# EasyEDA Pro project ProPrj_cap banks_2026-02-15.epro, board PCB5_1
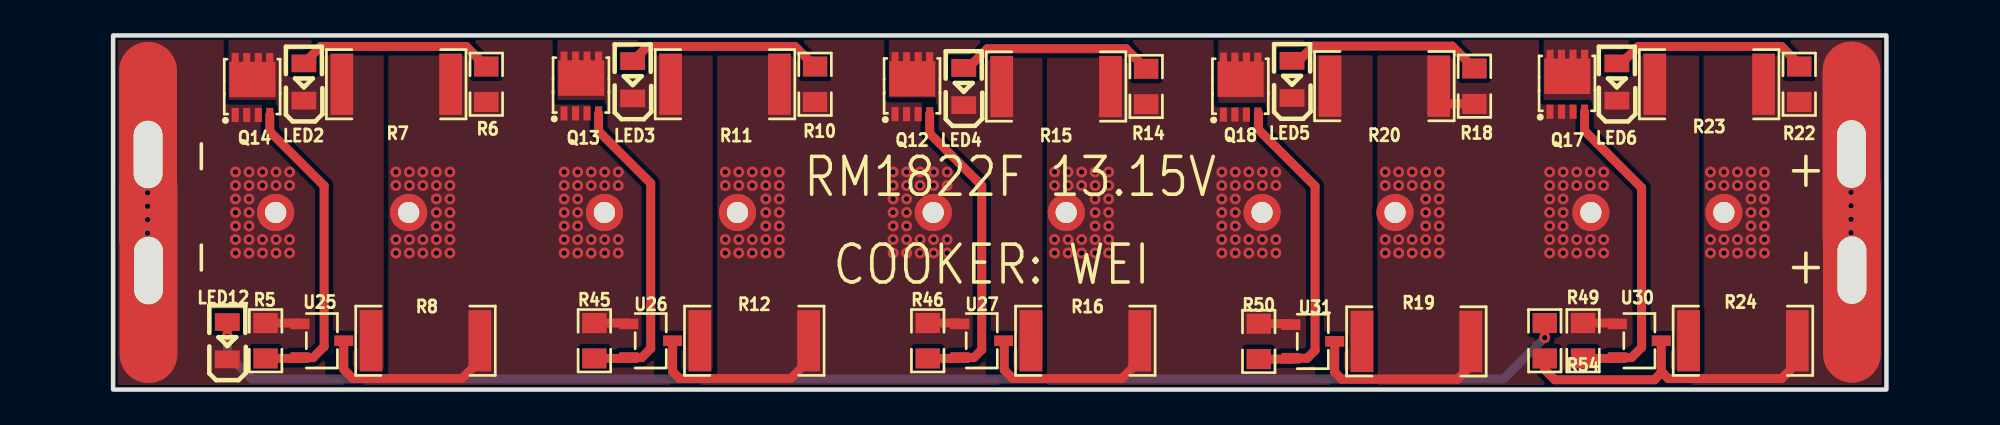
[diagram p6: board, top side]
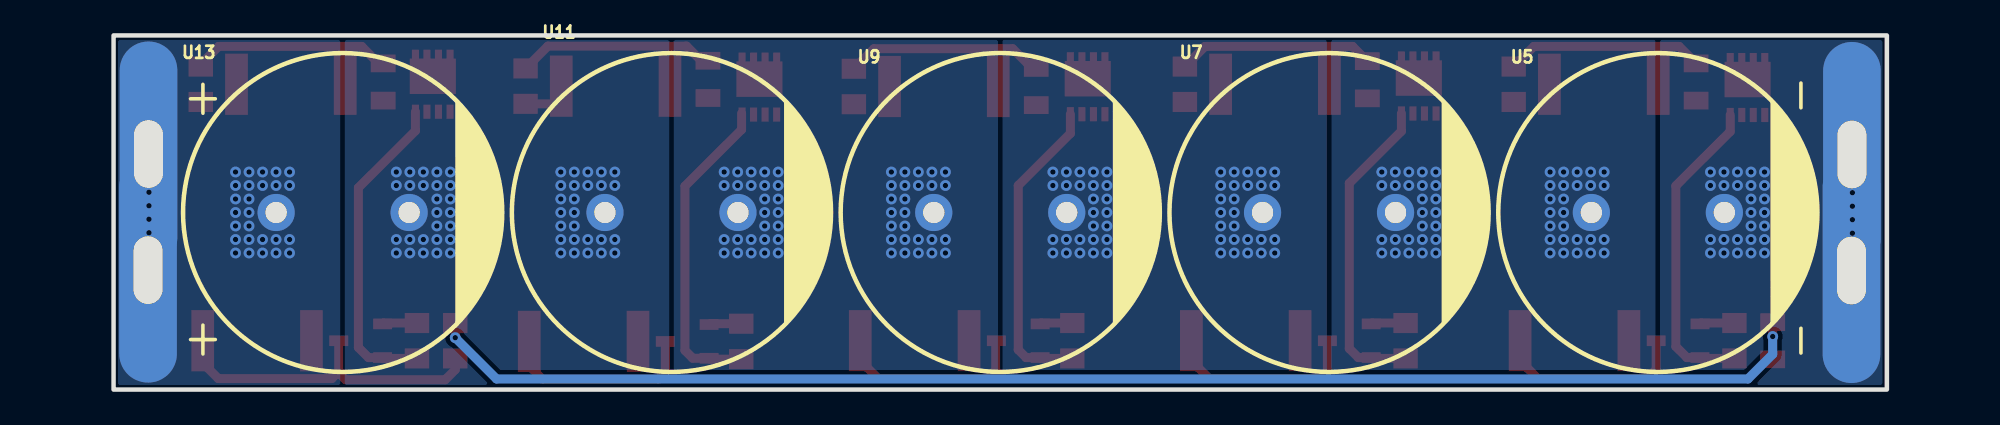
[diagram p7: board, bottom side, seen from below]

Outline 100 x 19.99 mm; copper layers: Top Layer, Bottom Layer. Coordinates in mm from the lower left corner of the outline.
Outline path: rectangle 0,19.99 100,0
Stack: Top Layer 0.035mm / Dielectric1 1.51mm FR4 er 4.5 / Bottom Layer 0.035mm

## Design rules (mm)
template: Custom Config
spacing copperThickness1oz (default): track to track 0.102, other pairs 0.152 to 0.3
spacing copperThickness2oz: track to track 0.203, other pairs 0.152 to 0.3
track width copperThickness1oz (default): min 0.127, default 0.508, max 2.54
track width copperThickness2oz: min 0.203, default 0.254, max 2.54
differential pair differentialPair (default): width min 0.127, default 0.254, max 2.54; gap min 0.152, default 0.152
via viaSize (default): diameter min 0.5, default 0.61, max 10; hole min 0.3, default 0.305, max 6.3

## Placement (name value [footprint] x y rotation side)
LED2  NCD0805R1  [LED0805-R-RD]  10.76 17.36 90 top
LED3  NCD0805R1  [LED0805-R-RD]  29.3 17.49 90 top
LED4  NCD0805R1  [LED0805-R-RD]  47.97 17.11 90 top
LED5  NCD0805R1  [LED0805-R-RD]  66.48 17.51 90 top
LED6  NCD0805R1  [LED0805-R-RD]  84.8 17.36 90 top
LED12  KT-0805G  [LED0805-R-RD]  6.44 2.76 90 top
NOREF  -  [Pad_e1076]  98.06 6.74 270 top
NOREF#2  -  [Pad_e1103]  1.97 13.27 90 top
NOREF#3  -  [Pad_e1102]  2 6.72 270 top
NOREF#4  -  [Pad_e1077]  98.03 13.3 90 top
Q12  AP2045Q  [DFN-8_L3.1-W3.0-P0.65-LS3.3-BL]  45.07 17.09 0 top
Q13  AP2045Q  [DFN-8_L3.1-W3.0-P0.65-LS3.3-BL]  26.4 17.14 0 top
Q14  AP2045Q  [DFN-8_L3.1-W3.0-P0.65-LS3.3-BL]  7.86 17.05 0 top
Q17  AP2045Q  [DFN-8_L3.1-W3.0-P0.65-LS3.3-BL]  82 17.23 0 top
Q18  AP2045Q  [DFN-8_L3.1-W3.0-P0.65-LS3.3-BL]  63.58 17.07 0 top
R5  30kΩ  [R0805]  8.6 2.76 270 top
R6  100Ω  [R0805]  21.04 17.23 270 top
R7  1Ω  [R2512]  15.96 17.23 0 top
R8  1Ω  [R2512]  17.62 2.76 0 top
R10  100Ω  [R0805]  39.59 17.23 270 top
R11  1Ω  [R2512]  34.51 17.23 0 top
R12  1Ω  [R2512]  36.16 2.76 0 top
R14  100Ω  [R0805]  58.26 17.11 270 top
R15  1Ω  [R2512]  53.17 17.11 0 top
R16  1Ω  [R2512]  54.83 2.76 0 top
R18  100Ω  [R0805]  76.77 17.13 270 top
R19  1Ω  [R2512]  73.49 2.72 0 top
R20  1Ω  [R2512]  71.69 17.13 0 top
R22  100Ω  [R0805]  95.08 17.23 270 top
R23  1Ω  [R2512]  90.01 17.23 0 top
R24  1Ω  [R2512]  91.91 2.76 0 top
R45  30kΩ  [R0805]  27.14 2.76 270 top
R46  30kΩ  [R0805]  45.94 2.76 270 top
R49  30kΩ  [R0805]  82.89 2.76 270 top
R50  30kΩ  [R0805]  64.61 2.72 270 top
R54  30kΩ  [R0805]  80.73 2.76 270 top
U5  1500uF  [CAP-TH_BD18.0-P7.50-D0.8-FD]  12.92 10 180 bottom
U7  1500uF  [CAP-TH_BD18.0-P7.50-D0.8-FD]  31.46 10 180 bottom
U9  1500uF  [CAP-TH_BD18.0-P7.50-D0.8-FD]  50 10 180 bottom
U11  1500uF  [CAP-TH_BD18.0-P7.50-D0.8-FD]  68.54 10 180 bottom
U13  1500uF  [CAP-TH_BD18.0-P7.50-D0.8-FD]  87.08 10 180 bottom
U25  LN809C2641MR-G  [SOT-23-3_L2.9-W1.6-P1.90-LS2.8-BR]  11.77 2.76 180 top
U26  LN809C2641MR-G  [SOT-23-3_L2.9-W1.6-P1.90-LS2.8-BR]  30.32 2.76 180 top
U27  LN809C2641MR-G  [SOT-23-3_L2.9-W1.6-P1.90-LS2.8-BR]  48.98 2.76 180 top
U30  LN809C2641MR-G  [SOT-23-3_L2.9-W1.6-P1.90-LS2.8-BR]  86.07 2.76 180 top
U31  LN809C2641MR-G  [SOT-23-3_L2.9-W1.6-P1.90-LS2.8-BR]  67.65 2.72 180 top

## Footprints (pads in the part's own frame, mm; a bottom-side part is the same pattern mirrored in y, then rotated)
CAP-TH_BD18.0-P7.50-D0.8-FD
  round 2.1 hole 1.2: 1(-3.75,0) 2(3.75,0)
DFN-8_L3.1-W3.0-P0.65-LS3.3-BL
  rect 0.4x0.8 smd: 1(-0.975,-1.55) 2(-0.325,-1.55) 3(0.326,-1.55) 4(0.975,-1.55) 5(0.975,1.55) 6(0.325,1.55) 7(-0.325,1.55) 8(-0.975,1.55)
  rect 2.6x2 smd: 8(-0.004,0.45)
LED0805-R-RD
  rect 1x1.399 smd: 1(1.05,0) 2(-1.05,0)
Pad_e1076
  oval 12.7x3.251 hole 3.81x1.625: 1(0,0)
Pad_e1077
  oval 12.7x3.251 hole 3.81x1.625: 1(0,0)
Pad_e1102
  oval 12.7x3.251 hole 3.81x1.625: 1(0,0)
Pad_e1103
  oval 12.7x3.251 hole 3.81x1.625: 1(0,0)
R0805
  rect 1.133x1.377 smd: 1(-1,0) 2(1,0)
R2512
  rect 1.282x3.456 smd: 1(-3.067,0) 2(3.067,0)
SOT-23-3_L2.9-W1.6-P1.90-LS2.8-BR
  rect 1.07x0.6 smd: 1(1.235,-0.95) 2(1.235,0.95) 3(-1.235,0)

## Nets
As in the schematic, except:
IN: LED12.2 NOREF#2.1 NOREF#3.1 Q14.1 Q14.2 Q14.3 R5.1 U5.2 U25.1
OUT: NOREF.1 NOREF#4.1 R22.2 R23.2 R24.2 R54.2 U13.1 U30.3

## Via types
v1: diameter 0.61, hole 0.305, Top Layer to Bottom Layer, 282 vias

## Routing (per net, layer and track width the routed paths; a pad name or vN(x,y) marks a point on that pad's centre or on a via; arc(x,y) is an arc through that point)
IN: length 2
  Top Layer w0.508: U25.1 10.49,3.76 R5.1
  vias: v1(1.95,13.4) v1(1.95,12.64) v1(1.95,11.87) v1(1.95,11.11) v1(1.95,10.35) v1(1.95,9.59) v1(1.95,8.83) v1(1.95,8.06) v1(1.95,7.3) v1(1.95,6.54) v1(6.9,12.28) v1(6.9,11.52) v1(6.9,10.76) v1(6.9,10) v1(6.9,9.23) v1(6.9,8.47) v1(6.9,7.71) v1(7.66,12.28) v1(7.66,11.52) v1(7.66,10.76) v1(7.66,10) v1(7.66,9.23) v1(7.66,8.47) v1(7.66,7.71) v1(8.43,12.28) v1(8.43,11.52) v1(8.43,8.47) v1(8.43,7.71) v1(9.19,12.28) v1(9.19,11.52) v1(9.19,8.47) v1(9.19,7.71) v1(9.95,12.28) v1(9.95,11.52) v1(9.95,8.47) v1(9.95,7.71)
NET2: length 13
  Top Layer w0.508: R8.2 20.68,1.63 19.67,0.62 13.53,0.62 13.01,1.14 U25.3 ; U26.1 29.03,3.76 R45.1
  vias: v1(15.94,12.28) v1(15.94,11.52) v1(15.94,8.47) v1(15.94,7.71) v1(16.71,12.28) v1(16.71,11.52) v1(16.71,8.47) v1(16.71,7.71) v1(17.47,12.28) v1(17.47,11.52) v1(17.47,8.47) v1(17.47,7.71) v1(18.23,12.28) v1(18.23,11.52) v1(18.23,10.76) v1(18.23,10) v1(18.23,9.23) v1(18.23,8.47) v1(18.23,7.71) v1(18.99,12.28) v1(18.99,11.52) v1(18.99,10.76) v1(18.99,10) v1(18.99,9.23) v1(18.99,8.47) v1(18.99,7.71) v1(25.44,12.28) v1(25.44,11.52) v1(25.44,10.76) v1(25.44,10) v1(25.44,9.23) v1(25.44,8.47) v1(25.44,7.71) v1(26.2,12.28) v1(26.2,11.52) v1(26.2,10.76) v1(26.2,10) v1(26.2,9.23) v1(26.2,8.47) v1(26.2,7.71) v1(26.96,12.28) v1(26.96,11.52) v1(26.96,8.47) v1(26.96,7.71) v1(27.72,12.28) v1(27.72,11.52) v1(27.72,8.47) v1(27.72,7.71) v1(28.48,12.28) v1(28.48,11.52) v1(28.48,8.47) v1(28.48,7.71)
NET3: length 13
  Top Layer w0.508: U26.3 31.55,1.01 31.94,0.62 38.21,0.62 39.22,1.63 R12.2 ; R46.1 47.7,3.76 47.75,3.71
  vias: v1(34.52,12.28) v1(34.52,11.52) v1(34.52,8.47) v1(34.52,7.71) v1(35.28,12.28) v1(35.28,11.52) v1(35.28,8.47) v1(35.28,7.71) v1(36.04,12.28) v1(36.04,11.52) v1(36.04,8.47) v1(36.04,7.71) v1(36.81,12.28) v1(36.81,11.52) v1(36.81,10.76) v1(36.81,10) v1(36.81,9.23) v1(36.81,8.47) v1(36.81,7.71) v1(37.57,12.28) v1(37.57,11.52) v1(37.57,10.76) v1(37.57,10) v1(37.57,9.23) v1(37.57,8.47) v1(37.57,7.71) v1(43.98,12.28) v1(43.98,11.52) v1(43.98,10.76) v1(43.98,10) v1(43.98,9.23) v1(43.98,8.47) v1(43.98,7.71) v1(44.75,12.28) v1(44.75,11.52) v1(44.75,10.76) v1(44.75,10) v1(44.75,9.23) v1(44.75,8.47) v1(44.75,7.71) v1(45.51,12.28) v1(45.51,11.52) v1(45.51,8.47) v1(45.51,7.71) v1(46.27,12.28) v1(46.27,11.52) v1(46.27,8.47) v1(46.27,7.71) v1(47.03,12.28) v1(47.03,11.52) v1(47.03,8.47) v1(47.03,7.71)
NET4: length 12.9
  Top Layer w0.508: R16.2 57.89,1.63 56.88,0.62 50.74,0.62 50.25,1.11 50.25,2.72 U27.3 ; R50.1 66.37,3.72 U31.1
  vias: v1(53.09,12.28) v1(53.09,11.52) v1(53.09,8.47) v1(53.09,7.71) v1(53.85,12.28) v1(53.85,11.52) v1(53.85,8.47) v1(53.85,7.71) v1(54.62,12.28) v1(54.62,11.52) v1(54.62,8.47) v1(54.62,7.71) v1(55.38,12.28) v1(55.38,11.52) v1(55.38,10.76) v1(55.38,10) v1(55.38,9.23) v1(55.38,8.47) v1(55.38,7.71) v1(56.14,12.28) v1(56.14,11.52) v1(56.14,10.76) v1(56.14,10) v1(56.14,9.23) v1(56.14,8.47) v1(56.14,7.71) v1(62.52,12.28) v1(62.52,11.52) v1(62.52,10.76) v1(62.52,10) v1(62.52,9.23) v1(62.52,8.47) v1(62.52,7.71) v1(63.28,12.28) v1(63.28,11.52) v1(63.28,10.76) v1(63.28,10) v1(63.28,9.23) v1(63.28,8.47) v1(63.28,7.71) v1(64.05,12.28) v1(64.05,11.52) v1(64.05,8.47) v1(64.05,7.71) v1(64.81,12.28) v1(64.81,11.52) v1(64.81,8.47) v1(64.81,7.71) v1(65.57,12.28) v1(65.57,11.52) v1(65.57,8.47) v1(65.57,7.71)
NET5: length 16.2
  Top Layer w0.508: 84.83,3.71 84.78,3.76 R49.1 ; R18.2 74.98,16.13 74.76,16.35 R20.2 ; 76.69,2.72 76.69,1.47 75.81,0.58 69.28,0.58 68.89,0.98 U31.3
  vias: v1(71.73,12.28) v1(71.73,11.52) v1(71.73,8.47) v1(71.73,7.71) v1(72.5,12.28) v1(72.5,11.52) v1(72.5,8.47) v1(72.5,7.71) v1(73.26,12.28) v1(73.26,11.52) v1(73.26,8.47) v1(73.26,7.71) v1(74.02,12.28) v1(74.02,11.52) v1(74.02,10.76) v1(74.02,10) v1(74.02,9.23) v1(74.02,8.47) v1(74.02,7.71) v1(74.78,12.28) v1(74.78,11.52) v1(74.78,10.76) v1(74.78,10) v1(74.78,9.23) v1(74.78,8.47) v1(74.78,7.71) v1(81.01,12.28) v1(81.01,11.52) v1(81.01,10.76) v1(81.01,10) v1(81.01,9.23) v1(81.01,8.47) v1(81.01,7.71) v1(81.77,12.28) v1(81.77,11.52) v1(81.77,10.76) v1(81.77,10) v1(81.77,9.23) v1(81.77,8.47) v1(81.77,7.71) v1(82.53,12.28) v1(82.53,11.52) v1(82.53,8.47) v1(82.53,7.71) v1(83.3,12.28) v1(83.3,11.52) v1(83.3,8.47) v1(83.3,7.71) v1(84.06,12.28) v1(84.06,11.52) v1(84.06,8.47) v1(84.06,7.71)
OUT: length 19
  Top Layer w0.508: U30.3 87.3,1.01 87.34,0.98 ; 87.24,0.88 87.44,0.88 ; 87.24,0.88 86.91,0.55 81.3,0.55 80.73,1.12 R54.2 ; 87.24,0.88 87.34,0.98 ; 87.44,0.88 87.69,0.62 94.09,0.62 94.98,1.5 R24.2 ; 87.44,0.88 87.34,0.98
  vias: v1(90.08,12.28) v1(90.08,11.52) v1(90.08,8.47) v1(90.08,7.71) v1(90.84,12.28) v1(90.84,11.52) v1(90.84,8.47) v1(90.84,7.71) v1(91.6,12.28) v1(91.6,11.52) v1(91.6,8.47) v1(91.6,7.71) v1(92.36,12.28) v1(92.36,11.52) v1(92.36,10.76) v1(92.36,10) v1(92.36,9.23) v1(92.36,8.47) v1(92.36,7.71) v1(93.13,12.28) v1(93.13,11.52) v1(93.13,10.76) v1(93.13,10) v1(93.13,9.23) v1(93.13,8.47) v1(93.13,7.71) v1(98.01,13.42) v1(98.01,12.66) v1(98.01,11.9) v1(98.01,11.14) v1(98.01,10.38) v1(98.01,9.61) v1(98.01,8.85) v1(98.01,8.09) v1(98.01,7.33) v1(98.01,6.57)
$1N1123: length 11.2
  Top Layer w0.508: R6.1 19.91,19.37 11.71,19.37 LED2.1
$1N1142: length 11.1
  Top Layer w0.508: LED3.1 30.13,19.37 38.45,19.37 R10.1
$1N1161: length 11.2
  Top Layer w0.508: LED4.1 48.22,18.16 49.3,19.24 57.12,19.24 R14.1
$1N1168: length 17.8
  Top Layer w0.508: 46.05,15.54 46.05,14.46 48.98,11.52 48.98,2.25 48.54,1.81 47.75,1.81 47.7,1.76 R46.2
$1N1174: length 17.9
  Top Layer w0.508: R5.2 10.49,1.76 U25.2 11.28,1.81 11.9,2.43 11.9,11.5 8.83,14.57 Q14.4
$1N1180: length 17.9
  Top Layer w0.508: Q13.4 27.38,14.59 30.32,11.65 30.32,2.31 29.81,1.81 U26.2 29.03,1.76 R45.2
$1N1899: length 11.2
  Top Layer w0.508: R18.1 75.51,19.39 67.69,19.39 66.86,18.56 LED5.1
$1N1901: length 18
  Top Layer w0.508: U31.2 66.37,1.72 R50.2 ; 66.55,1.77 67.34,1.77 67.78,2.21 67.78,11.48 64.59,14.67 64.59,15.59
$1N1917: length 11.2
  Top Layer w0.508: 84.92,18.28 86.01,19.37 94.08,19.37 95.21,18.23
$1N1919: length 18.2
  Top Layer w0.508: R49.2 84.78,1.76 84.83,1.81 85.63,1.81 86.2,2.38 86.2,11.39 82.98,14.61 Q17.4
$1N2137: length 78.5
  Top Layer w0.508: LED12.1 v1(6.44,3) ; R54.1 v1(80.73,2.93)
  Bottom Layer w0.508: v1(80.73,2.93) 78.4,0.6 7.84,0.6 6.44,1.99 v1(6.44,3)

## Copper pours and planes (outline as drawn; the poured copper is in the pictures)
IN on Top Layer: -3.85,23.46 13.68,23.46 13.68,-6.77 -3.85,-6.77
IN on Bottom Layer: -5.5,21.34 12.79,21.34 12.79,-3.64 -5.5,-3.64
NET2 on Top Layer: 14.06,21.68 31.46,21.68 31.46,-3.19 14.06,-3.19
NET2 on Bottom Layer: 13.04,21.01 31.33,21.01 31.33,-3.97 13.04,-3.97
NET3 on Top Layer: 33.11,20.79 50,20.79 50,-4.7 33.11,-4.7
NET3 on Bottom Layer: 31.58,21.6 49.87,21.6 49.87,-3.39 31.58,-3.39
NET4 on Top Layer: 52.67,21.78 68.67,21.78 68.67,-1.21 52.67,-1.21
NET4 on Bottom Layer: 50.13,20.45 68.42,20.45 68.42,-4.53 50.13,-4.53
NET5 on Top Layer: 71.29,19.9 86.37,19.9 86.37,-0.09 71.29,-0.09
NET5 on Bottom Layer: 68.67,21.34 86.96,21.34 86.96,-3.64 68.67,-3.64
OUT on Top Layer: 88.99,20.92 102.96,20.92 102.96,-3.09 88.99,-3.09
OUT on Bottom Layer: 87.21,22.23 105.5,22.23 105.5,-2.75 87.21,-2.75
$1N1124 on Top Layer: 12.22,0.98 12.22,11.77 9.17,14.82 9.17,16.34 6.5,16.34 6.5,20.03 15.14,20.03 15.14,19.77 15.27,19.77 15.27,0.98
$1N1143 on Top Layer: 30.76,0.98 30.76,11.77 27.71,14.82 27.71,16.34 25.04,16.34 25.04,20.03 33.68,20.03 33.68,19.77 33.81,19.77 33.81,0.98
$1N1162 on Top Layer: 49.46,0.98 49.46,11.77 46.41,14.82 46.41,16.47 43.75,16.47 43.75,20.03 52.45,20.03 52.45,0.98
$1N1900 on Top Layer: 68.03,0.94 68.03,11.73 64.99,14.78 64.99,16.18 62.32,16.18 62.32,19.99 70.95,19.99 70.95,19.74 71.08,19.74 71.08,0.94
$1N1918 on Top Layer: 86.39,0.98 86.39,11.77 83.34,14.82 83.34,16.34 80.67,16.34 80.67,20.03 89.31,20.03 89.31,19.77 89.43,19.77 89.43,0.98

## Text on the board
Bottom Silkscreen Layer: + | -
Top Silkscreen Layer: RM1822F 13.15V | COOKER: WEI | + | -
